# EAGLE design gatedriver_trafo_sma_compact_ACDC_ultra_smd (EAGLE 7.2.0)
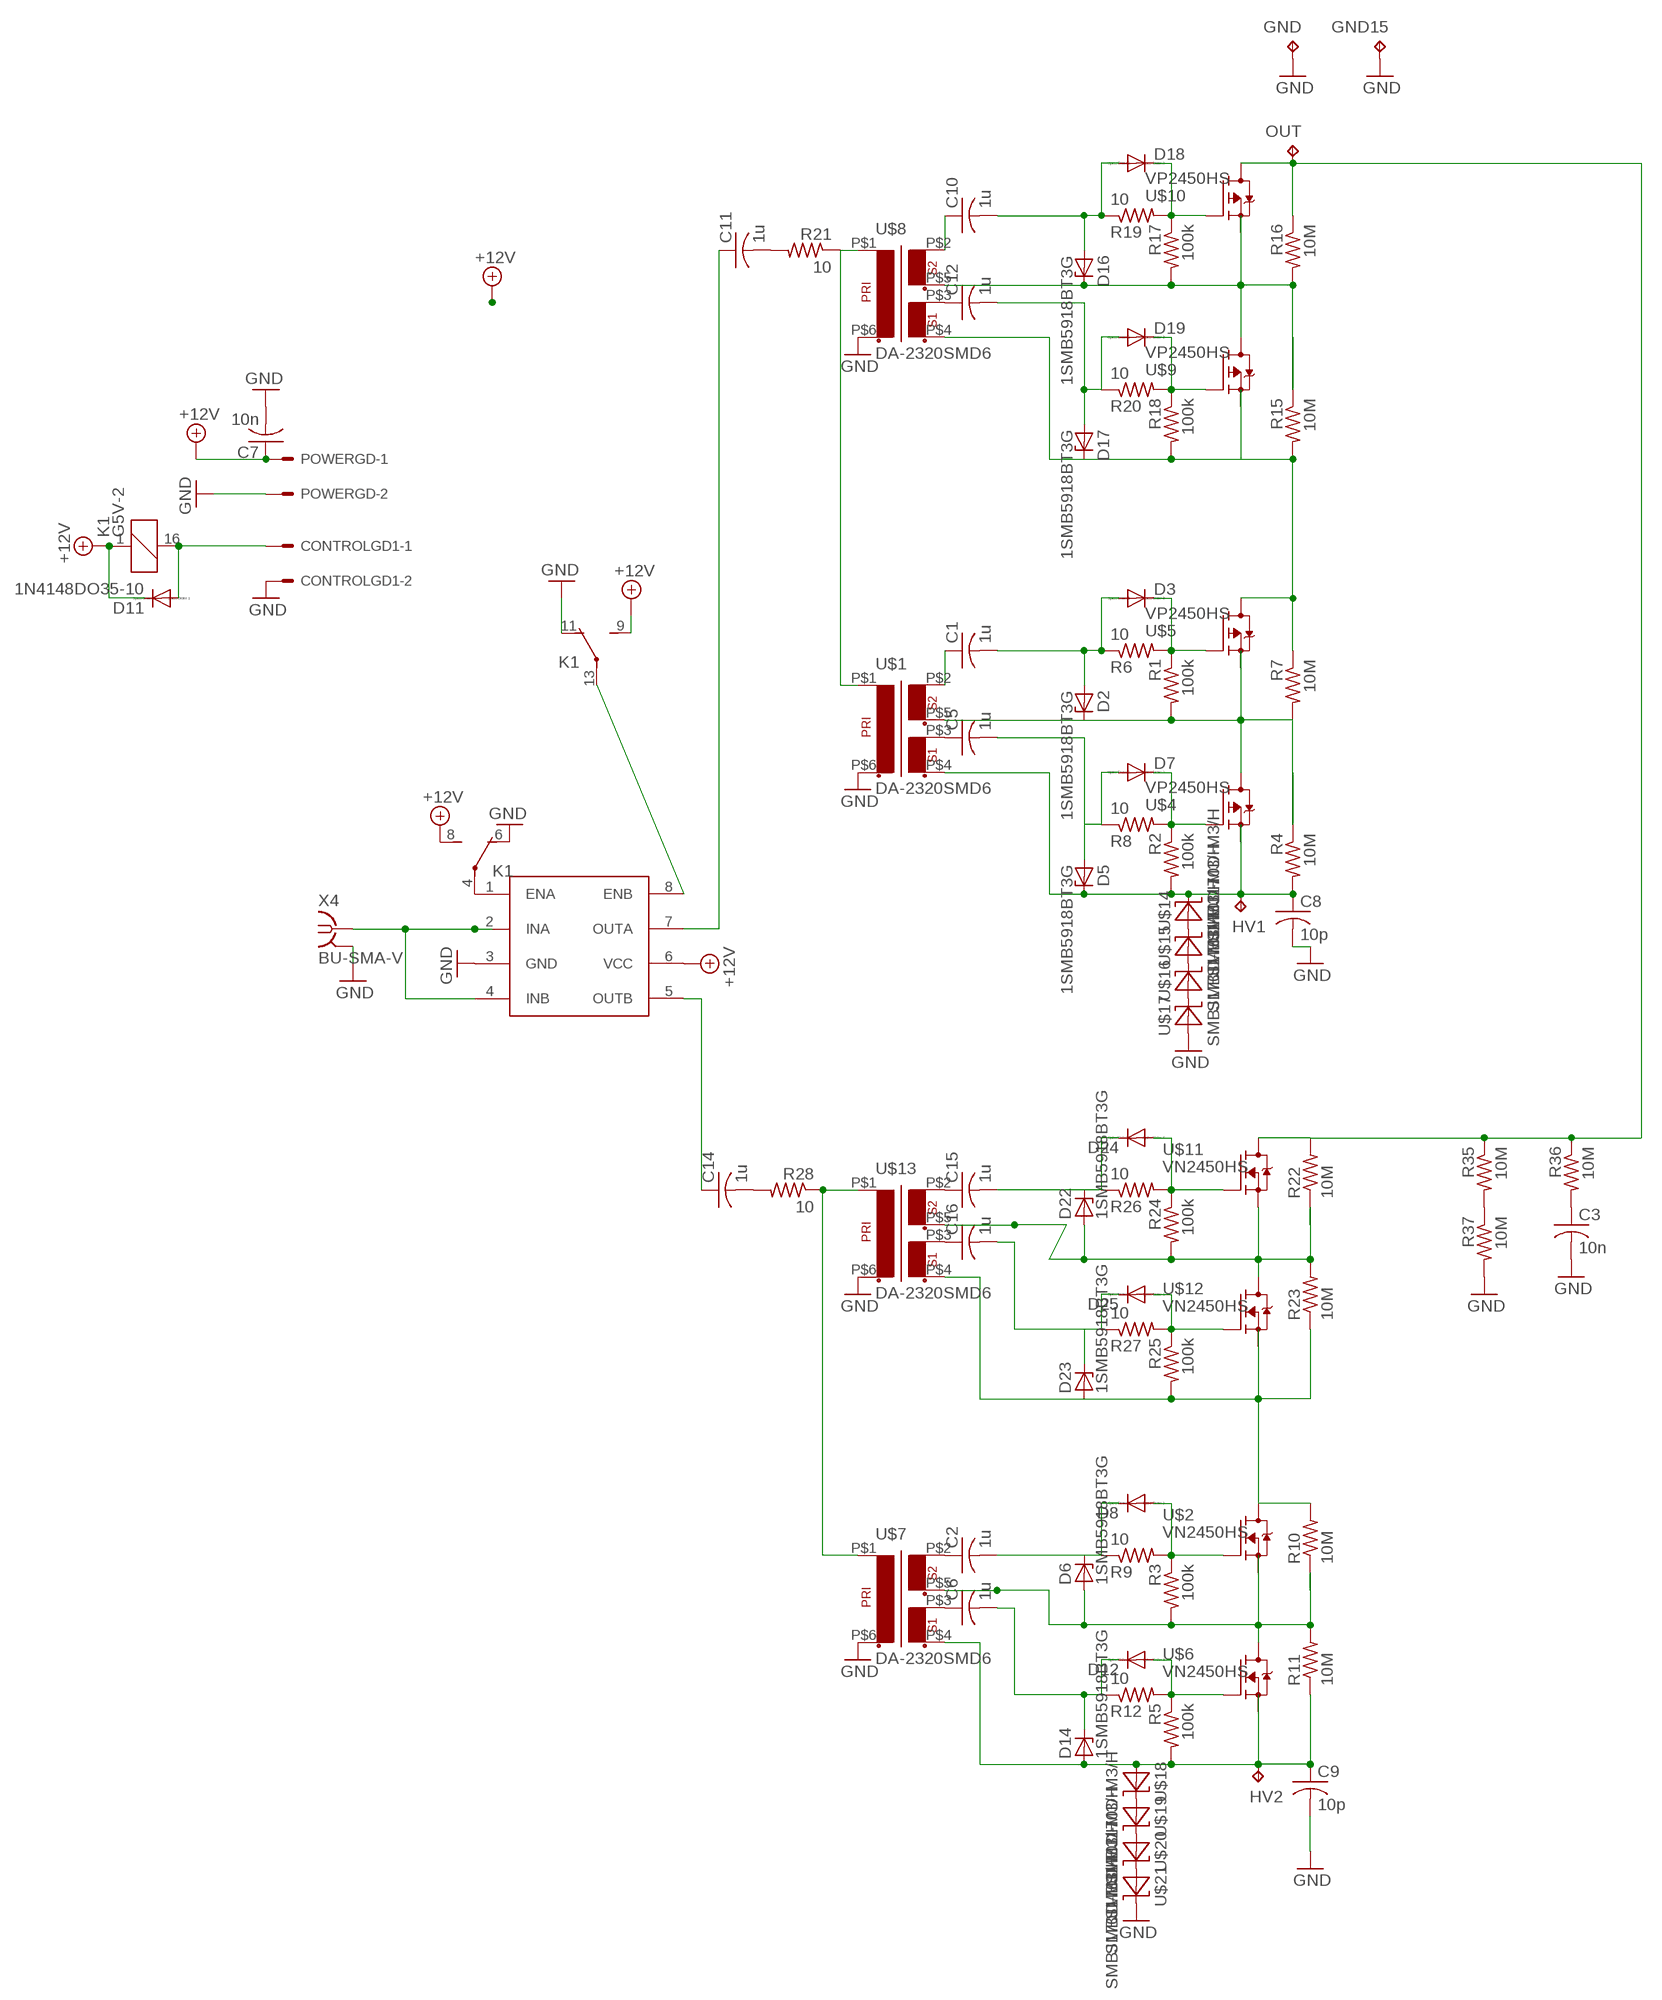
[diagram p0: schematic, sheet 1]

## Parts
C1  1u  C-USC0805  [C0805]
C2  1u  C-USC0805  [C0805]
C3  10n  C-USC0805  [C0805]
C5  1u  C-USC0805  [C0805]
C6  1u  C-USC0805  [C0805]
C7  10n  C-US050-030X075  [C050-030X075]
C8  10p  C-US102-064X133  [C102-064X133]
C9  10p  C-US102-064X133  [C102-064X133]
C10  1u  C-USC0805  [C0805]
C11  1u  C-USC0805  [C0805]
C12  1u  C-USC0805  [C0805]
C14  1u  C-USC0805  [C0805]
C15  1u  C-USC0805  [C0805]
C16  1u  C-USC0805  [C0805]
CONTROLGD1  KK-156-2  [KK-156-2]
D2  1SMB5918BT3G  ZENER-DIODESMB  [SMB]
D3  DIODE-SMB  [SMB]
D5  1SMB5918BT3G  ZENER-DIODESMB  [SMB]
D6  1SMB5918BT3G  ZENER-DIODESMB  [SMB]
D7  DIODE-SMB  [SMB]
D8  DIODE-SMB  [SMB]
D11  1N4148DO35-10  [DO35-10]
D12  DIODE-SMB  [SMB]
D14  1SMB5918BT3G  ZENER-DIODESMB  [SMB]
D16  1SMB5918BT3G  ZENER-DIODESMB  [SMB]
D17  1SMB5918BT3G  ZENER-DIODESMB  [SMB]
D18  DIODE-SMB  [SMB]
D19  DIODE-SMB  [SMB]
D22  1SMB5918BT3G  ZENER-DIODESMB  [SMB]
D23  1SMB5918BT3G  ZENER-DIODESMB  [SMB]
D24  DIODE-SMB  [SMB]
D25  DIODE-SMB  [SMB]
GND  TPPAD1-20Y  [P1-20Y]
GND15  TPPAD1-20Y  [P1-20Y]
HV1  TPPAD1-20Y  [P1-20Y]
HV2  TPPAD1-20Y  [P1-20Y]
K1  G5V-2  [G5V-2]
OUT  TPPAD1-20Y  [P1-20Y]
POWERGD  KK-156-2  [KK-156-2]
R1  100k  R-US_R0805  [R0805]
R2  100k  R-US_R0805  [R0805]
R3  100k  R-US_R0805  [R0805]
R4  10M  R-US_R2512  [R2512]
R5  100k  R-US_R0805  [R0805]
R6  10  R-US_R0805  [R0805]
R7  10M  R-US_R2512  [R2512]
R8  10  R-US_R0805  [R0805]
R9  10  R-US_R0805  [R0805]
R10  10M  R-US_R2512  [R2512]
R11  10M  R-US_R2512  [R2512]
R12  10  R-US_R0805  [R0805]
R15  10M  R-US_R2512  [R2512]
R16  10M  R-US_R2512  [R2512]
R17  100k  R-US_R0805  [R0805]
R18  100k  R-US_R0805  [R0805]
R19  10  R-US_R0805  [R0805]
R20  10  R-US_R0805  [R0805]
R21  10  R-US_R0805  [R0805]
R22  10M  R-US_R2512  [R2512]
R23  10M  R-US_R2512  [R2512]
R24  100k  R-US_R0805  [R0805]
R25  100k  R-US_R0805  [R0805]
R26  10  R-US_R0805  [R0805]
R27  10  R-US_R0805  [R0805]
R28  10  R-US_R0805  [R0805]
R35  10M  R-US_R2512  [R2512]
R36  10M  R-US_R2512  [R2512]
R37  10M  R-US_R2512  [R2512]
U$1  DA-2320SMD6  [SMD6]
U$2  VN2450HS  [SO89_HS]
U$3  UCC27425  [DIL08]
U$4  VP2450HS  [SO89_HS]
U$5  VP2450HS  [SO89_HS]
U$6  VN2450HS  [SO89_HS]
U$7  DA-2320SMD6  [SMD6]
U$8  DA-2320SMD6  [SMD6]
U$9  VP2450HS  [SO89_HS]
U$10  VP2450HS  [SO89_HS]
U$11  VN2450HS  [SO89_HS]
U$12  VN2450HS  [SO89_HS]
U$13  DA-2320SMD6  [SMD6]
U$14  SMBJ170D-M3/H  [DO214AA]
U$15  SMBJ170D-M3/H  [DO214AA]
U$16  SMBJ170D-M3/H  [DO214AA]
U$17  SMBJ170D-M3/H  [DO214AA]
U$18  SMBJ170D-M3/H  [DO214AA]
U$19  SMBJ170D-M3/H  [DO214AA]
U$20  SMBJ170D-M3/H  [DO214AA]
U$21  SMBJ170D-M3/H  [DO214AA]
X4  BU-SMA-V  [BU-SMA-V]

## Nets
+15V: C7.1 D11.C K1.1 K1.8(1:S) K1.9(2:S) POWERGD.1 U$3.6(VCC) ; supply symbol labelled +12V
ENSW: CONTROLGD1.1 D11.A K1.16
GND: C3.2 C7.2 C8.2 C9.2 CONTROLGD1.2 GND15.TP GND.TP K1.6(1:O) K1.11(2:O) POWERGD.2 R37.2 U$1.P$6 U$3.3(GND) U$7.P$6 U$8.P$6 U$13.P$6 U$17.A U$21.C X4.2 X4.3 X4.4 X4.5
N$1: U$3.2(INA) U$3.4(INB) X4.1
N$2: C11.1 U$3.7(OUTA)
N$3: D16.C R15.1 R16.2 R17.2 U$8.P$5 U$9.C(D) U$9.C@1(D) U$10.E(S)
N$4: C14.1 U$3.5(OUTB)
N$5: C1.1 U$1.P$2
N$6: C8.1 D5.C HV1.TP R2.2 R4.2 U$1.P$4 U$4.E(S) U$14.C
N$7: C5.1 U$1.P$3
N$8: D3.C R1.1 R6.2 U$5.B(G)
N$9: D2.C R1.2 R4.1 R7.2 U$1.P$5 U$4.C(D) U$4.C@1(D) U$5.E(S)
N$10: C1.2 D2.A D3.A R6.1
N$11: D12.A R5.1 R12.2 U$6.B(G)
N$12: D7.C R2.1 R8.2 U$4.B(G)
N$14: K1.4(1:P) U$3.1(ENA)
N$15: K1.13(2:P) U$3.8(ENB)
N$16: C5.2 D5.A D7.A R8.1
N$20: D23.A R10.2 R23.1 R25.2 U$2.C(D) U$2.C@1(D) U$12.E(S) U$13.P$4
N$21: D6.A R3.2 R10.1 R11.2 U$2.E(S) U$6.C(D) U$6.C@1(D) U$7.P$5
N$22: C2.1 U$7.P$2
N$23: C6.1 U$7.P$3
N$25: C2.2 D6.C D8.C R9.1
N$26: OUT.TP R16.1 R22.2 R35.1 R36.1 U$10.C(D) U$10.C@1(D) U$11.C(D) U$11.C@1(D)
N$27: C6.2 D12.C D14.C R12.1
N$28: C10.1 U$8.P$2
N$29: C12.1 U$8.P$3
N$30: C12.2 D17.A D19.A R20.1
N$31: C9.1 D14.A HV2.TP R5.2 R11.1 U$6.E(S) U$7.P$4 U$18.A
N$34: D18.C R17.1 R19.2 U$10.B(G)
N$35: C10.2 D16.A D18.A R19.1
N$36: D19.C R18.1 R20.2 U$9.B(G)
N$37: R21.1 U$1.P$1 U$8.P$1
N$38: C11.2 R21.2
N$39: C3.1 R36.2
N$40: C15.1 U$13.P$2
N$41: C16.1 U$13.P$3
N$42: C15.2 D22.C D24.C R26.1
N$43: C16.2 D23.C D25.C R27.1
N$44: R35.2 R37.1
N$45: U$14.A U$15.C
N$46: D22.A R22.1 R23.2 R24.2 U$11.E(S) U$12.C(D) U$12.C@1(D) U$13.P$5
N$47: D25.A R25.1 R27.2 U$12.B(G)
N$48: R28.1 U$7.P$1 U$13.P$1
N$49: C14.2 R28.2
N$50: D24.A R24.1 R26.2 U$11.B(G)
N$52: U$15.A U$16.C
N$53: U$16.A U$17.C
N$54: U$18.C U$19.A
N$55: U$19.C U$20.A
N$56: U$20.C U$21.A
N$57: D17.C R7.1 R15.2 R18.2 U$5.C(D) U$5.C@1(D) U$8.P$4 U$9.E(S)
N$251: D8.A R3.1 R9.2 U$2.B(G)

## Library data of the parts
C1-C3 C5 C6 C8-C12 C14-C16 = resistor:C-US: CAPACITOR, American symbol
C7 = rcl:C-US: CAPACITOR, American symbol
CONTROLGD1 POWERGD = con-molex:KK-156-2: KK 156 HEADER Source: http://www.molex.com/pdm_docs/sd/026604100_sd.pdf; OC_FARNELL: unknown; OC_NEWARK: unknown
D2 D5 D6 D14 D16 D17 D22 D23 = diode:ZENER-DIODE: Z-Diode
D3 D7 D8 D12 D18 D19 D24 D25 = diode:DIODE-: DIODE
D11 = diode:1N4148: DIODE high speed (Philips)
GND GND15 HV1 HV2 OUT = testpad:TP: Test pad
K1 = relay:G5V-2: OMRON PCB Relay Source: http://www.omron.com/ecb/products/pdf/en-g5v2.pdf; MPN: G5V-2 5DC; OC_FARNELL: 9949488; OC_NEWARK: 78K5703
R1-R12 R15-R28 R35-R37 = rcl:R-US_: RESISTOR, American symbol
U$1 U$7 U$8 U$13 = trafo:DA-2320
U$2 U$6 U$11 U$12 = transistor-fet:VN2450
U$3 = texas:UCC27425
U$4 U$5 U$9 U$10 = transistor-fet:VP2450
U$14-U$21 = diode:SMBJ170D-M3/H
X4 = con-coax:BU-SMA-V: FEMALE SMA CONNECTOR Radiall distributor RS 112-3794; OC_FARNELL: unknown; OC_NEWARK: unknown

## Board
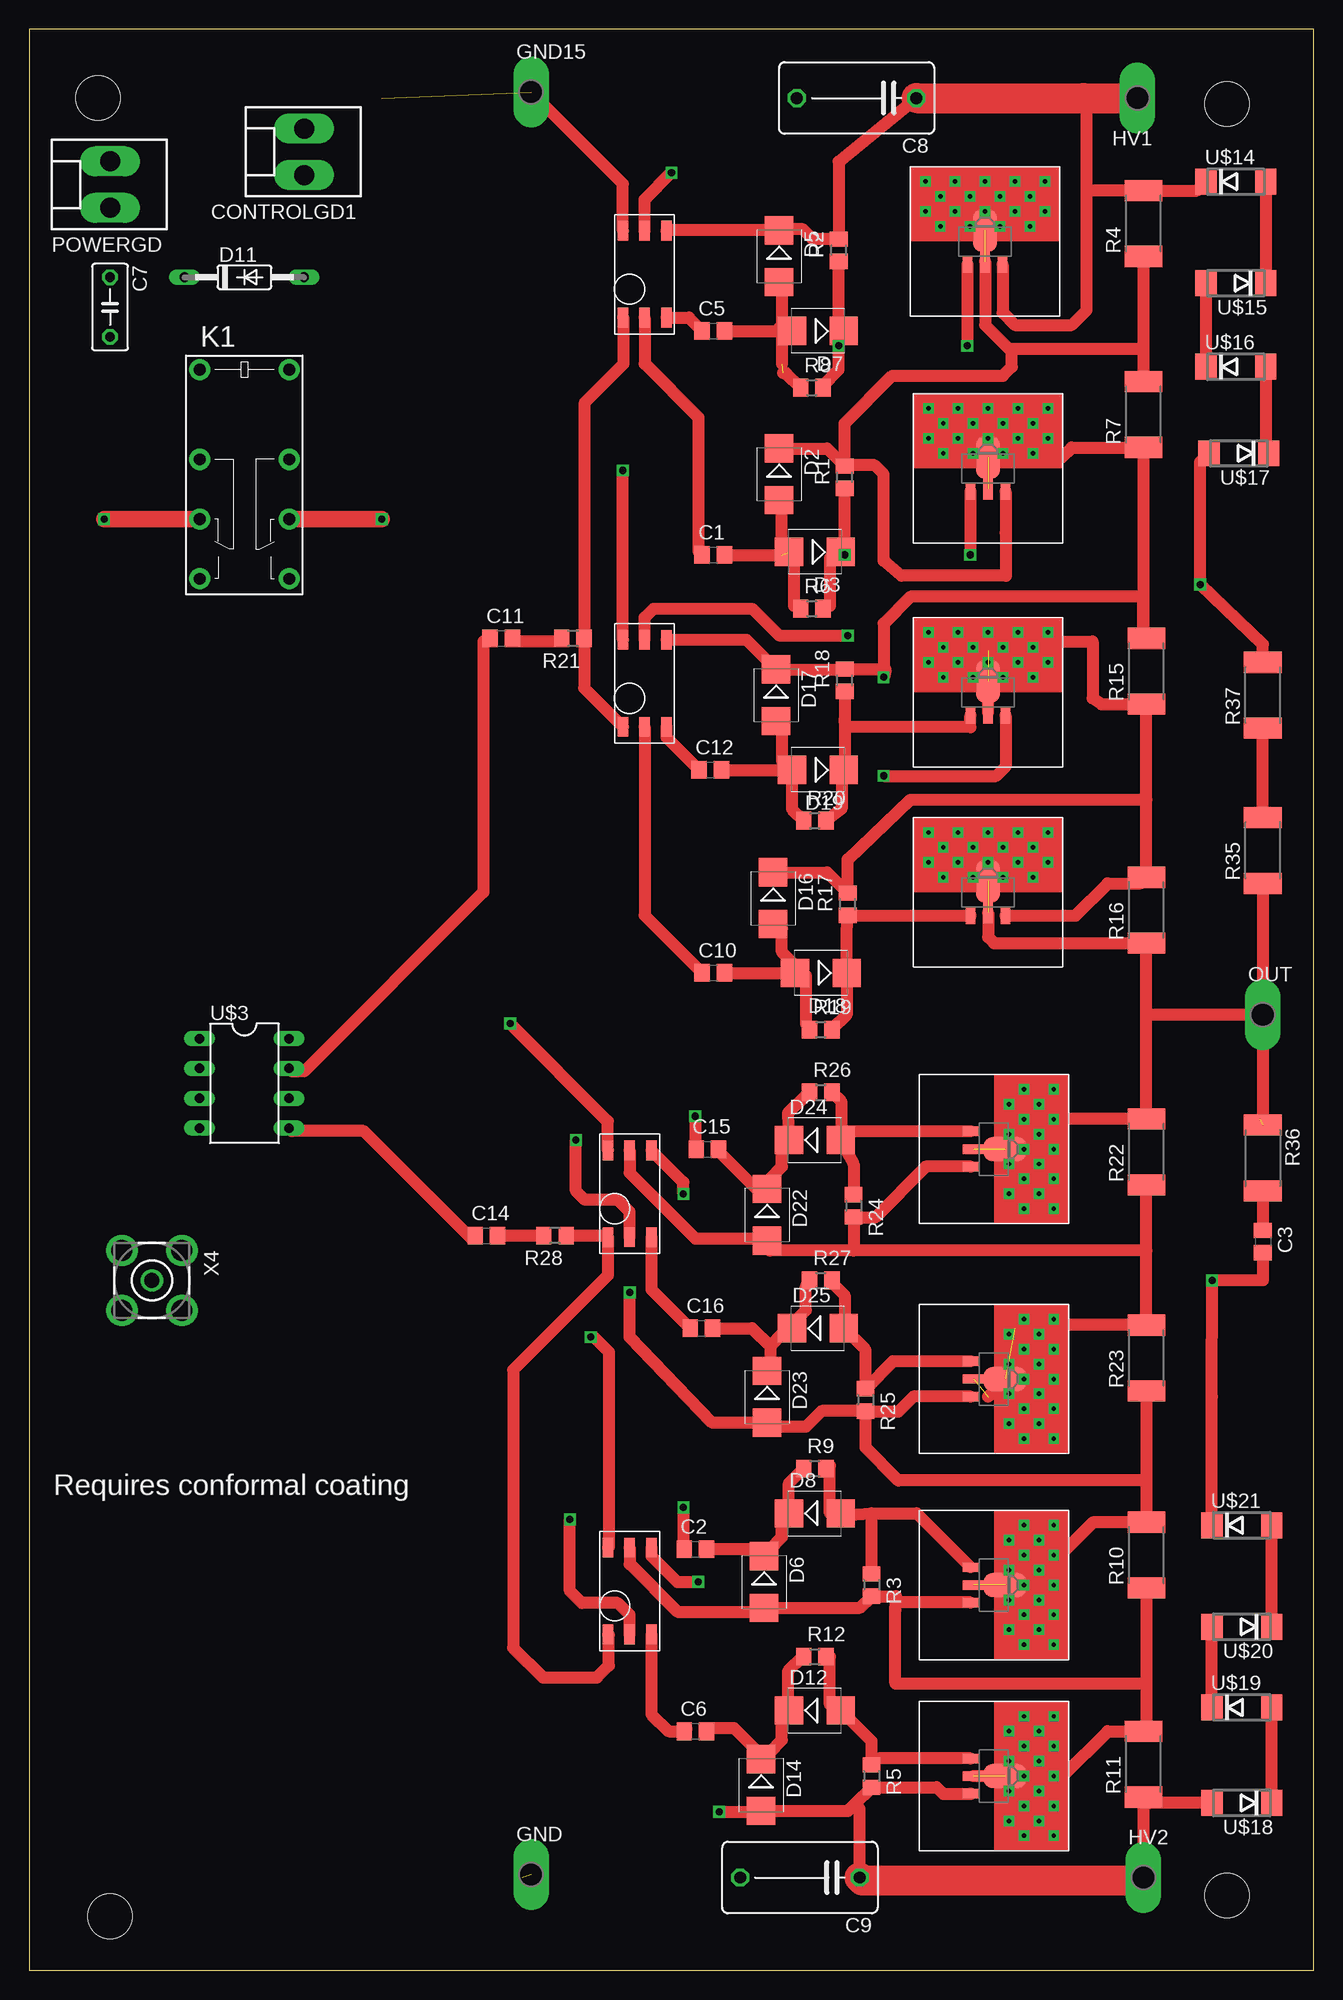
[diagram p1: board, top side]
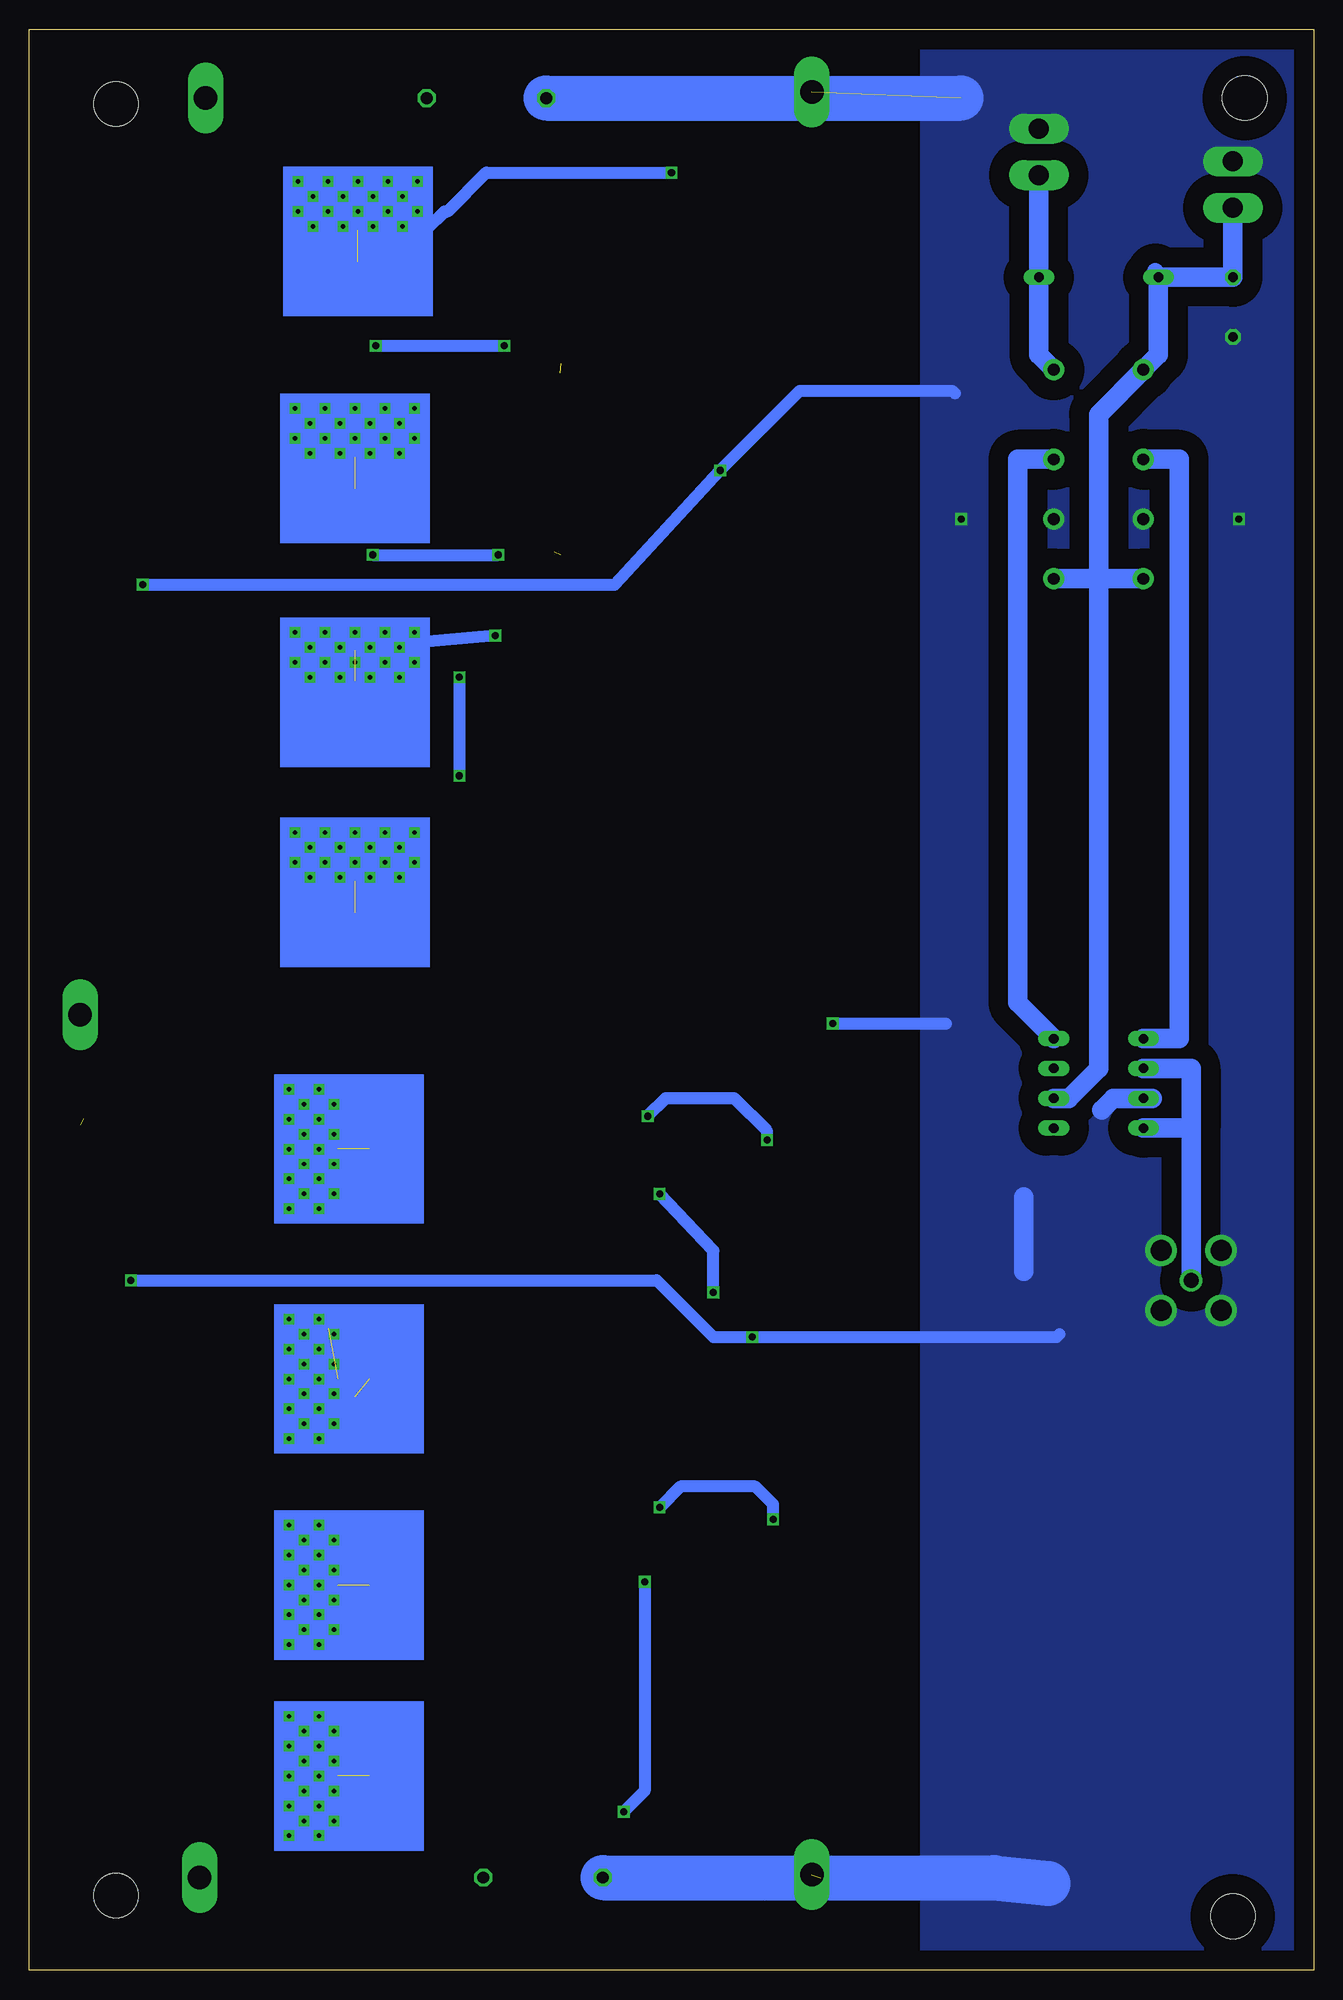
[diagram p2: board, bottom side, seen from below]

Size 109.22 x 165.1 mm. Coordinates in mm from the lower left corner, seen from the top.
Outline: 0,0 109.22,0 109.22,165.1 0,165.1 0,0
Copper layers (1*16): Top 0.035mm / dielectric 1.5mm / Bottom 0.035mm
Design rules "default *": minimum track width 6mil, minimum drill 15mil, track to track 6mil, track to pad 6mil, pad to pad 6mil, via to via 6mil, smd to smd 6mil, copper to edge 40mil, drill to drill 8mil, minimum pad ring 10mil, minimum via ring 8mil, stop-mask expansion 4mil, vias tented up to drill 0mil, thermal gap 10mil
Holes 3.8 mm at 101.85,158.75 101.85,6.35 6.86,4.57 5.84,159.26

### Footprints (pad centres in the part's own frame; a part is rotated, then mirrored left to right if it is on the bottom)
C0805 = smd 1.3 x 1.5: 1 -0.95,0; 2 0.95,0
C050-030X075 = drill 0.813 octagon: 1 -2.54,0; 2 2.54,0
C102-064X133 = drill 1.016 octagon: 1 -5.08,0; 2 5.08,0
KK-156-2 = drill 1.7 pad 2.184 long: 1 -1.98,0; 2 1.98,0
SMB = smd 2.4 x 2.4: A 2.2,0; C -2.2,0
DO35-10 = drill 0.813 long: A 5.08,0; C -5.08,0
P1-20Y = drill 2.007 pad 2.54 long: TP 0,0
G5V-2 = drill 1 pad 1.8: 1 -8.89,-3.81; 4 -1.27,-3.81; 6 3.81,-3.81; 8 8.89,-3.81; 9 8.89,3.81; 11 3.81,3.81; 13 -1.27,3.81; 16 -8.89,3.81
R0805 = smd 1.3 x 1.5: 1 -0.95,0; 2 0.95,0
R2512 = smd 1.8 x 3.2: 1 -2.8,0; 2 2.8,0
SMD6 = smd 1.676 x 0.889: P$1 -3.696,1.854; P$2 -3.696,0; P$3 -3.696,-1.854; P$4 3.696,-1.854; P$5 3.696,0; P$6 3.696,1.854
SO89_HS = smd 0.8 x 1.4: B -1.499,-1.981; E 1.499,-1.981 | smd 0.8 x 1.9: C 0,-1.727 | smd 2.032 x 3.65: C@1 0,0.94 | drill 0.381 square: P$1 -3.81,3.81; P$2 -1.27,3.81; P$3 1.27,3.81; P$4 3.81,3.81; P$5 3.81,1.27; P$6 1.27,1.27; P$7 -1.27,1.27; P$8 -3.81,1.27; P$9 -2.54,5.08; P$10 -5.08,2.54; P$11 -2.54,2.54; P$12 -5.08,5.08; P$13 0,5.08; P$14 2.54,5.08; P$15 5.08,5.08; P$16 5.08,2.54; P$17 2.54,2.54; P$18 0,2.54
DIL08 = drill 0.813 long: 1 -3.81,-3.81; 2 -1.27,-3.81; 3 1.27,-3.81; 4 3.81,-3.81; 5 3.81,3.81; 6 1.27,3.81; 7 -1.27,3.81; 8 -3.81,3.81
DO214AA = smd 1.8 x 2.2: A 2.55,0; C -2.55,0
BU-SMA-V = drill 1.27: 1 0,0 | drill 1.778: 2 -2.55,2.55; 3 2.55,2.55; 4 2.55,-2.55; 5 -2.55,-2.55

### Placement (x,y rotation side)
C1  58.17,120.4 0 top
C2  56.64,35.81 0 top
C3  104.9,61.98 270 top
C5  58.17,139.45 0 top
C6  56.64,20.32 0 top
C7  6.86,141.48 270 top
C8  70.36,159.26 180 top
C9  65.53,7.87 180 top
C10  58.17,84.84 0 top
C11  40.13,113.28 0 top
C12  57.91,102.11 0 top
C14  38.86,62.48 0 top
C15  57.66,69.85 0 top
C16  57.15,54.61 0 top
CONTROLGD1  23.37,154.69 90 top
D2  63.75,127.25 270 top
D3  66.8,120.65 180 top
D5  63.75,145.8 270 top
D6  62.48,33.02 270 top
D7  67.06,139.45 180 top
D8  66.8,38.86 0 top
D11  18.29,144.02 0 top
D12  66.8,22.1 0 top
D14  62.23,15.75 270 top
D16  63.25,91.19 270 top
D17  63.5,108.46 270 top
D18  67.31,84.84 180 top
D19  67.06,102.11 180 top
D22  62.74,64.26 270 top
D23  62.74,48.77 270 top
D24  66.8,70.61 0 top
D25  67.06,54.61 0 top
GND  42.67,8.13 0 top
GND15  42.67,159.77 0 top
HV1  94.23,159.26 180 top
HV2  94.74,7.87 0 top
K1  18.29,127.25 270 top
OUT  104.9,81.28 0 top
POWERGD  6.86,151.89 90 top
R1  69.34,127 90 top
R2  68.83,146.3 90 top
R3  71.63,32.77 270 top
R4  94.74,148.59 90 top
R5  71.63,16.51 270 top
R6  66.55,115.82 0 top
R7  94.74,132.33 90 top
R8  66.55,134.62 0 top
R9  66.8,42.67 0 top
R10  95,35.31 90 top
R11  94.74,17.53 90 top
R12  66.8,26.67 0 top
R15  95,110.49 90 top
R16  95,90.17 90 top
R17  69.6,90.68 90 top
R18  69.34,109.73 90 top
R19  67.31,80.01 0 top
R20  66.8,97.79 0 top
R21  46.23,113.28 180 top
R22  95,69.6 90 top
R23  95,52.07 90 top
R24  70.1,65.02 270 top
R25  71.12,48.51 270 top
R26  67.31,74.68 0 top
R27  67.31,58.67 0 top
R28  44.7,62.48 180 top
R35  104.9,95.25 90 top
R36  104.9,69.09 270 top
R37  104.9,108.46 90 top
U$1  52.32,144.27 90 top
U$2  82.04,32.77 270 top
U$3  18.29,75.44 270 top
U$4  81.28,147.07 0 top
U$5  81.53,127.76 0 top
U$6  82.04,16.51 270 top
U$7  51.05,32.26 90 top
U$8  52.32,109.47 90 top
U$9  81.53,108.71 0 top
U$10  81.53,91.69 0 top
U$11  82.04,69.85 270 top
U$12  82.04,50.29 270 top
U$13  51.05,66.04 90 top
U$14  102.62,152.15 0 top
U$15  102.62,143.51 180 top
U$16  102.62,136.4 0 top
U$17  102.87,129.03 180 top
U$18  103.12,14.22 180 top
U$19  103.12,22.35 0 top
U$20  103.12,29.21 180 top
U$21  103.12,37.85 0 top
X4  10.41,58.67 270 top

### Tracks (layer width: path | path; a pad name or v marks a point on that pad's centre or on a via)
+15V
  Bottom 1.016: 13.21,144.53 D11.C
  Bottom 1.422: 13.46,144.02 13.46,144.53
  Bottom 1.676: D11.C 13.21,137.41 K1.1 18.29,132.33 18.29,118.36 | 18.29,118.36 18.29,76.71 20.83,74.17 U$3.6 | 18.29,118.36 K1.9 | K1.8 18.29,118.36 | POWERGD.1 C7.1 D11.C | D11.C 13.46,144.02
ENSW
  Bottom 1.676: CONTROLGD1.1 D11.A 23.37,137.41 K1.16
GND  (via drill 0.6)  (2 unrouted)
  Top 1.016: v47.75,53.85 48.01,53.85 49.28,52.58 49.28,36.03 U$7.P$6 | U$1.P$6 50.47,151.97 GND15.TP | U$8.P$6 v50.47,127.58 | U$13.P$6 49.2,72.21 v40.89,80.52 | 104.65,111 R37.2 104.9,112.78 v99.57,117.86 99.57,128.28 U$17.A | U$21.C 100.57,48.78 v100.58,58.67 104.9,58.67 C3.2
  Top 1.422: K1.6 v6.35,123.44 | K1.11 v29.97,123.44
  Bottom 1.016: 15.24,74.17 15.24,74.42 U$3.3 | 21.59,54.1 21.84,53.85 v47.75,53.85 51.05,53.85 55.88,58.67 v100.58,58.67 | 30.48,134.11 30.73,134.37 43.69,134.37 v50.47,127.58 59.44,117.86 v99.57,117.86 | v40.89,80.52 31.24,80.52
  Bottom 1.422: 41.66,8.13 41.91,7.87
  Bottom 1.676: 24.64,65.79 24.64,59.44 | 18.03,73.15 17.02,74.17 15.24,74.17 U$3.3 13.72,74.17
  Bottom 3.81: 46.69,7.82 27.18,7.85 | 27.18,7.85 22.61,7.37 | C8.2 29.97,159.26 | C9.2 41.91,7.87 27.18,7.87 27.18,7.85
  pour Bottom (isolate 1.676, no thermals): 0,163.32 33.27,163.32 33.27,0.76 0,0.76
N$1
  Bottom 1.676: X4.1 10.41,71.63 | U$3.2 10.41,76.71 10.41,71.63 | 10.41,71.63 U$3.4
N$2
  Top 1.016: U$3.7 22.35,76.45 23.37,76.45 38.61,91.69 38.61,113.03 C11.1
N$3  (via drill 0.6)  (2 unrouted)
  Top 1.016: U$10.E 88.95,89.71 91.69,92.46 94.48,92.46 R16.2 95,99.57 | U$9.C 81.53,112.27 83.31,113.28 87.12,113.03 90.42,113.03 90.42,108.2 91.19,107.7 R15.1 95,99.57 | U$8.P$5 52.32,115.06 53.09,115.82 61.47,115.82 63.75,113.54 v69.6,113.54 | D16.C 67.84,93.39 R17.2 69.6,94.49 74.93,99.57 95,99.57
  Bottom 1.016: v69.6,113.54 81.03,112.52 81.53,112.01
N$4
  Top 1.016: U$3.5 22.35,71.37 28.45,71.37 37.59,62.23 C14.1
N$5
  Top 1.016: U$1.P$2 52.32,136.65 56.9,132.08 56.9,120.72 C1.1
N$6
  Top 1.016: C8.1 68.83,153.86 R2.2 66.61,147.25 65.79,148.08 63.84,148.08 D5.C 54.21,148 U$1.P$4 | U$4.E 82.78,141 83.82,139.95 88.65,139.95 89.92,141.22 89.92,151.64 | 89.92,151.64 89.92,159 89.66,159.26 | 89.92,151.64 90.16,151.39 R4.2 99.31,151.39 U$14.C
  Top 2.54: C8.1 89.66,159.26 HV1.TP
N$7
  Top 1.016: U$1.P$3 56.09,140.58 C5.1
N$8  (via drill 0.6)
  Top 1.016: R6.2 68.07,116.08 68.07,120.14 D3.C 69.34,120.65 v69.34,120.4 R1.1 | U$5.B 80.03,123.22 v80.01,120.4
  Bottom 1.016: v80.01,120.4 v69.34,120.4
N$9  (via drill 0.6)  (2 unrouted)
  Top 1.016: 83.03,122.27 U$5.E 83.03,118.64 83.06,118.62 74.17,118.62 72.64,119.89 72.64,127.25 71.88,128.02 69.41,128.02 R1.2 | U$1.P$5 52.32,150.62 v54.61,152.91 | R4.1 94.74,137.92 | 94.74,137.92 R7.2 | U$4.C 81.28,139.95 83.31,137.92 | 83.31,137.92 94.74,137.92 | D2.C 67.84,129.45 R1.2 | R1.2 69.34,131.57 73.41,135.64 82.8,135.64 83.57,136.4 83.57,137.67 83.31,137.92
  Bottom 1.016: v54.61,152.91 70.36,152.91 73.66,149.61 73.91,149.61 75.44,148.08 81.2,148.08 U$4.C@1
N$10  (1 unrouted)
  Top 1.016: R6.1 65.02,116.08 65.02,120.14 D3.A 64.01,121.16 64.01,124.21 D2.A | C1.2 64.01,120.4
N$11
  Top 1.016: R12.2 68.07,26.67 68.07,22.61 D12.A 71.63,19.47 R5.1 72.18,18.01 U$6.B
N$12  (via drill 0.6)
  Top 1.016: v68.83,138.18 68.83,139.7 69.85,139.45 D7.C | v68.83,138.18 R2.1 | U$4.B 79.78,142.01 v79.76,138.18 | R8.2 67.5,134.81 68.83,136.14 v68.83,138.18
  Bottom 1.016: v79.76,138.18 v68.83,138.18
N$14
  Bottom 1.676: 13.97,79.25 U$3.1 11.43,79.25 11.43,128.52 K1.4
N$15
  Bottom 1.676: K1.13 25.15,128.52 25.15,82.3 U$3.8
N$16  (1 unrouted)
  Top 1.016: 64.01,139.95 64.01,143.51 D5.A | 64.01,139.95 64.01,139.45 | C5.2 63.5,139.45 64.01,139.95 | D7.A 64.01,139.45 | 64.01,139.45 64.01,136.65 | 64.09,135.87 64.35,135.87 R8.1
N$20  (via drill 0.6)  (1 unrouted)
  Top 1.016: R25.2 71.19,47.5 73.91,47.5 75.21,48.79 U$12.E | R25.2 67.38,47.56 66.04,46.23 63.08,46.23 D23.A 58.08,46.57 51.05,53.85 v51.05,57.66 | v55.63,66.04 55.63,67.02 U$13.P$4 | R25.2 71.12,44.45 73.91,41.66 94.74,41.66 95,41.91 R23.1 R10.2 90.48,38.11 84.55,32.17 | U$2.C@1 84.55,32.17 | 84.55,32.17 87.45,31.06
  Bottom 1.016: v51.05,57.66 51.05,61.21 v55.63,66.04
N$21  (1 unrouted)
  Top 1.016: U$7.P$5 51.05,34.54 55.12,30.48 62.14,30.48 D6.A 70.63,30.82 R3.2 73.73,31.82 73.7,31.27 | R10.1 95,24.38 | 95,24.38 95,20.58 R11.2 91.69,20.32 87.88,16.51 U$6.C | 95,24.38 73.66,24.38 73.66,30.61 73.7,31.27 | U$2.E 73.7,31.27
N$22  (via drill 0.6)
  Top 1.016: 55.63,35.75 C2.1 55.63,35.88 v55.63,39.37 | U$7.P$2 51.05,30.23 50.04,31.24 46.99,31.24 45.97,32.26 v45.97,38.35
  Bottom 1.016: v45.97,38.35 45.97,39.62 47.5,41.15 53.85,41.15 v55.63,39.37
N$23
  Top 1.016: 55.88,20.51 C6.1 54.36,20.32 52.91,21.77 U$7.P$3
N$25
  Top 1.016: C2.2 61.98,35.81 D6.C 62.99,35.81 64.01,36.83 64.01,38.86 D8.C 64.6,41.42 R9.1
N$26  (3 unrouted)
  Top 1.016: 81.53,92.71 U$10.C@1 | R22.2 95,81.28 | 95,81.28 R16.1 | R16.1 | R22.2 | 95,81.28 OUT.TP | U$10.C 81.53,87.88 82.04,87.38 90.18,87.38 R16.1 | R35.1 OUT.TP | OUT.TP 104.9,72.64 104.65,72.39 | R22.2 82.98,72.4 U$11.C@1
N$27
  Top 1.016: C6.2 57.91,20.57 59.94,20.57 61.98,18.54 D14.C 62.99,18.54 64.01,19.56 64.01,21.59 D12.C 64.52,22.18 64.52,25.4 65.79,26.67 R12.1
N$28
  Top 1.016: U$8.P$2 52.32,89.73 C10.1
N$29
  Top 1.016: U$8.P$3 54.18,104.89 C12.1
N$30
  Top 1.016: 64.39,102.53 64.01,102.87 64.01,105.92 D17.A | 64.39,102.53 D19.A 64.86,98.79 R20.1 | C12.2 63.97,102.11 64.39,102.53
N$31  (via drill 0.6)
  Top 1.016: U$7.P$4 52.91,35.23 55.12,33.02 v56.9,33.02 | v58.67,13.46 62.14,13.46 D14.A 69.62,13.55 70.2,14.13 | 70.2,14.13 R5.2 77.15,15.56 77.72,14.99 80.04,14.99 U$6.E | U$18.A 95.24,14.22 R11.1 | R11.1 HV2.TP | C9.1 70.61,13.72 70.2,14.13 | R11.1 94.74,7.62
  Top 2.54: 94.74,7.62 70.87,7.62 C9.1
  Bottom 1.016: v56.9,33.02 56.9,15.24 v58.67,13.46
N$34
  Top 1.016: U$10.B 80.02,89.73 R17.1 69.51,88.37 D18.C 69.51,81.26 R19.2
N$35
  Top 1.016: R19.1 66.04,80.52 66.04,84.58 D18.A | D16.A 64.01,88.65 64.01,86.61 65.02,85.6 D18.A | C10.2 D18.A
N$36
  Top 1.016: R20.2 69.09,98.81 69.09,101.85 D19.C 69.34,103.21 69.34,106.43 | R18.1 69.34,106.43 | U$9.B 80.02,105.73 69.41,105.73 69.34,106.43
N$37
  Top 1.016: U$8.P$1 47.18,109.07 R21.1 47.24,113.28 47.24,133.35 50.55,136.65 50.55,140.5 U$1.P$1
N$38
  Top 1.016: C11.2 41.66,113.03 44.7,113.03 R21.2
N$39
  Top 1.016: R36.2 C3.1
N$40  (via drill 0.6)
  Top 1.016: U$13.P$2 51.05,64.52 50.04,65.53 47.24,65.53 46.48,66.29 v46.48,70.61 | v56.64,72.64 56.64,69.92 C15.1
  Bottom 1.016: v46.48,70.61 46.48,71.37 49.28,74.17 55.12,74.17 v56.64,72.64
N$41
  Top 1.016: U$13.P$3 52.91,57.9 C16.1
N$42
  Top 1.016: R26.1 66.04,74.42 64.52,72.9 D24.C 64.01,70.36 64.01,68.33 62.99,67.31 D22.C 61.98,66.29 58.93,69.34 C15.2
N$43
  Top 1.016: R27.1 66.04,58.17 66.04,56.13 65.02,55.12 D25.C 64.01,54.1 62.99,53.09 | 62.99,53.09 62.99,51.05 D23.C | C16.2 61.47,54.61 62.99,53.09
N$44
  Top 1.016: R35.2 R37.1
N$45
  Top 1.016: U$14.A U$15.C
N$46  (2 unrouted)
  Top 1.016: 95,61.21 70.1,61.21 | 70.1,61.21 62.99,61.21 D22.A 62.57,62.23 56.64,62.23 51.05,67.82 U$13.P$5 | 81.53,48.77 U$12.C@1 | 70.17,63.5 R24.2 | R24.2 70.1,61.21 | 95,61.21 R23.2 84.08,54.87 83.82,54.61 | 95,61.21 R22.1 | R24.2 70.17,64.01 71.88,64.01 76.22,68.35 U$11.E
N$47
  Top 1.016: R27.2 68.26,58.49 69.34,57.4 69.34,54.7 D25.A 71.12,52.75 R25.1 73.45,51.79 U$12.B
N$48
  Top 1.016: R28.1 49.06,62.48 U$13.P$1 49.2,59.11 41.15,51.05 41.15,27.43 43.69,24.89 48.26,24.89 49.28,25.91 49.28,28.49 U$7.P$1
N$49
  Top 1.016: C14.2 R28.2
N$50
  Top 1.016: R24.1 70.1,68.58 69.09,70.36 | 69.09,70.36 D24.A | 69.09,70.36 69.09,71.35 | R26.2 69.09,73.85 69.09,71.37 69.09,71.35 | U$11.B 69.09,71.35
N$52
  Top 1.016: U$15.A U$16.C
N$53
  Top 1.016: U$16.A 105.17,129.29 U$17.C
N$54
  Top 1.016: U$18.C U$19.A
N$55
  Top 1.016: U$19.C U$20.A
N$56
  Top 1.016: U$20.C U$21.A
N$57  (via drill 0.6)  (1 unrouted)
  Top 1.016: U$9.E 83.03,102.4 82.23,101.6 v72.64,101.6 | U$5.C@1 87.81,128.7 88.65,129.54 R7.1 94.74,116.84 | 94.74,116.84 94.74,113.54 | 94.74,113.54 R15.2 | U$8.P$4 60.99,113.17 D17.C 69.32,110.66 R18.2 72.83,110.68 v72.64,109.98 72.64,114.55 74.93,116.84 94.74,116.84 | 94.74,113.54 94.74,116.84
  Bottom 1.016: v72.64,109.98 v72.64,101.6
N$251
  Top 1.016: R9.2 68.07,42.93 68.07,38.86 D8.A 69,38.69 71.63,38.86 | R3.1 71.63,38.86 | 71.63,38.86 75.46,38.86 U$2.B

### Text on the board
tPlace: Requires conformal coating